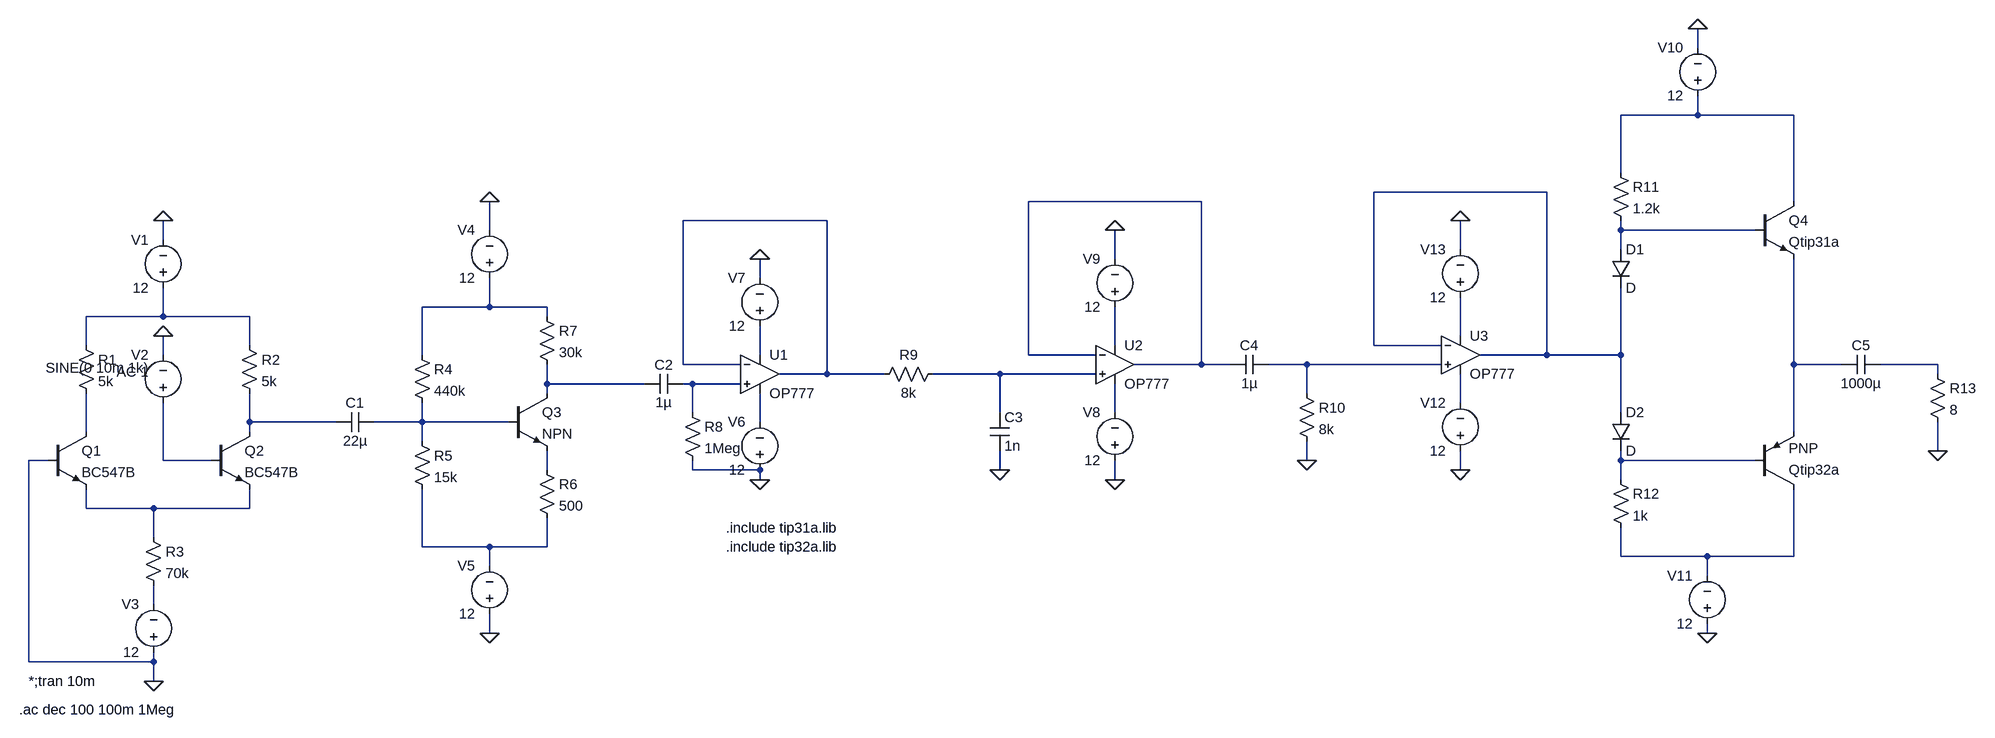
[diagram p0: schematic audamp.asc]
audamp.asc, the LTspice schematic file:
Version 4
SHEET 1 3460 680
WIRE 2992 -560 2992 -592
WIRE 2992 -448 2992 -480
WIRE 2992 -448 2864 -448
WIRE 3152 -448 2992 -448
WIRE 2864 -352 2864 -448
WIRE 2672 -320 2384 -320
WIRE 2096 -304 1808 -304
WIRE 3152 -304 3152 -448
WIRE 1472 -272 1232 -272
WIRE 816 -256 816 -304
WIRE 2864 -256 2864 -272
WIRE 3088 -256 2864 -256
WIRE 272 -240 272 -272
WIRE 2528 -224 2528 -272
WIRE 2864 -224 2864 -256
WIRE 1952 -208 1952 -256
WIRE 1360 -176 1360 -208
WIRE 816 -128 816 -176
WIRE 816 -128 704 -128
WIRE 912 -128 816 -128
WIRE 272 -112 272 -160
WIRE 272 -112 144 -112
WIRE 416 -112 272 -112
WIRE 912 -112 912 -128
WIRE 2528 -80 2528 -144
WIRE 144 -64 144 -112
WIRE 416 -64 416 -112
WIRE 1952 -64 1952 -128
WIRE 2384 -64 2384 -320
WIRE 2496 -64 2384 -64
WIRE 272 -48 272 -80
WIRE 704 -48 704 -128
WIRE 1360 -48 1360 -96
WIRE 1808 -48 1808 -304
WIRE 1920 -48 1808 -48
WIRE 2672 -48 2672 -320
WIRE 2672 -48 2560 -48
WIRE 2864 -48 2864 -160
WIRE 2864 -48 2672 -48
WIRE 1232 -32 1232 -272
WIRE 1328 -32 1232 -32
WIRE 2096 -32 2096 -304
WIRE 2096 -32 1984 -32
WIRE 2144 -32 2096 -32
WIRE 2272 -32 2208 -32
WIRE 2496 -32 2272 -32
WIRE 3152 -32 3152 -208
WIRE 3232 -32 3152 -32
WIRE 3392 -32 3296 -32
WIRE 1472 -16 1472 -272
WIRE 1472 -16 1392 -16
WIRE 1568 -16 1472 -16
WIRE 1760 -16 1648 -16
WIRE 1920 -16 1760 -16
WIRE 3392 -16 3392 -32
WIRE 912 0 912 -32
WIRE 1168 0 912 0
WIRE 1248 0 1232 0
WIRE 1328 0 1248 0
WIRE 912 16 912 0
WIRE 2272 16 2272 -32
WIRE 2528 32 2528 -16
WIRE 1248 48 1248 0
WIRE 1760 48 1760 -16
WIRE 1952 48 1952 0
WIRE 2864 48 2864 -48
WIRE 416 64 416 16
WIRE 560 64 416 64
WIRE 704 64 704 32
WIRE 704 64 624 64
WIRE 848 64 704 64
WIRE 1360 64 1360 16
WIRE 144 80 144 16
WIRE 416 80 416 64
WIRE 3152 80 3152 -32
WIRE 704 96 704 64
WIRE 3392 112 3392 64
WIRE 80 128 48 128
WIRE 272 128 272 32
WIRE 352 128 272 128
WIRE 2272 128 2272 96
WIRE 2864 128 2864 112
WIRE 3088 128 2864 128
WIRE 912 144 912 112
WIRE 1248 144 1248 128
WIRE 1360 144 1248 144
WIRE 1760 144 1760 112
WIRE 2528 144 2528 112
WIRE 1360 160 1360 144
WIRE 1952 160 1952 128
WIRE 2864 160 2864 128
WIRE 144 208 144 176
WIRE 256 208 144 208
WIRE 416 208 416 176
WIRE 416 208 256 208
WIRE 256 256 256 208
WIRE 704 272 704 176
WIRE 816 272 704 272
WIRE 912 272 912 224
WIRE 912 272 816 272
WIRE 2864 288 2864 240
WIRE 3008 288 2864 288
WIRE 3152 288 3152 176
WIRE 3152 288 3008 288
WIRE 816 304 816 272
WIRE 3008 320 3008 288
WIRE 256 368 256 336
WIRE 816 416 816 384
WIRE 3008 416 3008 400
WIRE 48 464 48 128
WIRE 256 464 256 448
WIRE 256 464 48 464
WIRE 256 496 256 464
FLAG 272 -80 0
FLAG 272 -272 0
FLAG 256 496 0
FLAG 816 -304 0
FLAG 816 416 0
FLAG 1360 -208 0
FLAG 1360 160 0
FLAG 1760 144 0
FLAG 1952 160 0
FLAG 1952 -256 0
FLAG 2272 128 0
FLAG 2992 -592 0
FLAG 3008 416 0
FLAG 3392 112 0
FLAG 2528 144 0
FLAG 2528 -272 0
SYMBOL npn 80 80 R0
SYMATTR InstName Q1
SYMATTR Value BC547B
SYMBOL npn 352 80 R0
SYMATTR InstName Q2
SYMATTR Value BC547B
SYMBOL voltage 272 -144 R180
WINDOW 0 24 96 Left 2
WINDOW 3 24 16 Left 2
WINDOW 123 0 0 Left 0
WINDOW 39 0 0 Left 0
SYMATTR InstName V1
SYMATTR Value 12
SYMBOL voltage 272 48 R180
WINDOW 0 24 96 Left 2
WINDOW 3 24 74 Left 2
WINDOW 123 24 68 Left 2
WINDOW 39 0 0 Left 0
SYMATTR InstName V2
SYMATTR Value SINE(0 10m 1k)
SYMATTR Value2 AC 1
SYMBOL voltage 256 464 R180
WINDOW 0 24 96 Left 2
WINDOW 3 24 16 Left 2
WINDOW 123 0 0 Left 0
WINDOW 39 0 0 Left 0
SYMATTR InstName V3
SYMATTR Value 12
SYMBOL res 128 -80 R0
SYMATTR InstName R1
SYMATTR Value 5k
SYMBOL res 400 -80 R0
SYMATTR InstName R2
SYMATTR Value 5k
SYMBOL res 240 240 R0
SYMATTR InstName R3
SYMATTR Value 70k
SYMBOL cap 624 48 R90
WINDOW 0 0 32 VBottom 2
WINDOW 3 32 32 VTop 2
SYMATTR InstName C1
SYMATTR Value 22µ
SYMBOL res 688 -64 R0
SYMATTR InstName R4
SYMATTR Value 440k
SYMBOL res 688 80 R0
SYMATTR InstName R5
SYMATTR Value 15k
SYMBOL res 896 128 R0
SYMATTR InstName R6
SYMATTR Value 500
SYMBOL res 896 -128 R0
SYMATTR InstName R7
SYMATTR Value 30k
SYMBOL npn 848 16 R0
SYMATTR InstName Q3
SYMBOL voltage 816 -160 R180
WINDOW 0 24 96 Left 2
WINDOW 3 24 16 Left 2
WINDOW 123 0 0 Left 0
WINDOW 39 0 0 Left 0
SYMATTR InstName V4
SYMATTR Value 12
SYMBOL voltage 816 400 R180
WINDOW 0 24 96 Left 2
WINDOW 3 24 16 Left 2
SYMATTR InstName V5
SYMATTR Value 12
SYMBOL OP777 1360 -80 R0
SYMATTR InstName U1
SYMBOL voltage 1360 160 R180
WINDOW 0 24 96 Left 2
WINDOW 3 24 16 Left 2
SYMATTR InstName V6
SYMATTR Value 12
SYMBOL voltage 1360 -80 R180
WINDOW 0 24 96 Left 2
WINDOW 3 24 16 Left 2
SYMATTR InstName V7
SYMATTR Value 12
SYMBOL res 1664 -32 R90
WINDOW 0 0 56 VBottom 2
WINDOW 3 32 56 VTop 2
SYMATTR InstName R9
SYMATTR Value 8k
SYMBOL cap 1744 48 R0
SYMATTR InstName C3
SYMATTR Value 1n
SYMBOL OP777 1952 -96 R0
SYMATTR InstName U2
SYMBOL voltage 1952 144 R180
WINDOW 0 24 96 Left 2
WINDOW 3 24 16 Left 2
SYMATTR InstName V8
SYMATTR Value 12
SYMBOL voltage 1952 -112 R180
WINDOW 0 24 96 Left 2
WINDOW 3 24 16 Left 2
SYMATTR InstName V9
SYMATTR Value 12
SYMBOL cap 2208 -48 R90
WINDOW 0 0 32 VBottom 2
WINDOW 3 32 32 VTop 2
SYMATTR InstName C4
SYMATTR Value 1µ
SYMBOL res 2256 0 R0
SYMATTR InstName R10
SYMATTR Value 8k
SYMBOL cap 1232 -16 R90
WINDOW 0 0 32 VBottom 2
WINDOW 3 32 32 VTop 2
SYMATTR InstName C2
SYMATTR Value 1µ
SYMBOL res 1232 32 R0
SYMATTR InstName R8
SYMATTR Value 1Meg
SYMBOL diode 2848 -224 R0
SYMATTR InstName D1
SYMBOL diode 2848 48 R0
SYMATTR InstName D2
SYMBOL res 2848 -368 R0
SYMATTR InstName R11
SYMATTR Value 1.2k
SYMBOL res 2848 144 R0
SYMATTR InstName R12
SYMATTR Value 1k
SYMBOL npn 3088 -304 R0
SYMATTR InstName Q4
SYMATTR Value Qtip31a
SYMBOL pnp 3088 176 M180
SYMATTR InstName Qtip32a
SYMBOL voltage 2992 -464 R180
WINDOW 0 24 96 Left 2
WINDOW 3 24 16 Left 2
SYMATTR InstName V10
SYMATTR Value 12
SYMBOL voltage 3008 416 R180
WINDOW 0 24 96 Left 2
WINDOW 3 24 16 Left 2
SYMATTR InstName V11
SYMATTR Value 12
SYMBOL cap 3296 -48 R90
WINDOW 0 0 32 VBottom 2
WINDOW 3 32 32 VTop 2
SYMATTR InstName C5
SYMATTR Value 1000µ
SYMBOL res 3376 -32 R0
SYMATTR InstName R13
SYMATTR Value 8
SYMBOL OP777 2528 -112 R0
SYMATTR InstName U3
SYMBOL voltage 2528 128 R180
WINDOW 0 24 96 Left 2
WINDOW 3 24 16 Left 2
SYMATTR InstName V12
SYMATTR Value 12
SYMBOL voltage 2528 -128 R180
WINDOW 0 24 96 Left 2
WINDOW 3 24 16 Left 2
SYMATTR InstName V13
SYMATTR Value 12
TEXT 48 496 Left 2 !*;tran 10m
TEXT 1304 240 Left 2 !.include tip31a.lib
TEXT 1304 272 Left 2 !.include tip32a.lib
TEXT 32 544 Left 2 !.ac dec 100 100m 1Meg

The netlist it stands for:
* audamp.asc
Q1 N022 0 N026 0 BC547B
Q2 N019 N023 N026 0 BC547B
V1 N007 0 12
V2 N023 0 SINE(0 10m 1k) AC 1
V3 0 N029 12
R1 N007 N022 5k
R2 N007 N019 5k
R3 N026 N029 70k
C1 N020 N019 22µ
R4 N006 N020 440k
R5 N020 N027 15k
R6 N025 N027 500
R7 N006 N015 30k
Q3 N015 N020 N025 0 NPN
V4 N006 0 12
V5 0 N027 12
XU1 N016 N004 N010 N021 N004 OP777  ; pins In+ In- V+ V- OUT
V6 0 N021 12
V7 N010 0 12
R9 N014 N004 8k
C3 N014 0 1n
XU2 N014 N003 N009 N018 N003 OP777  ; pins In+ In- V+ V- OUT
V8 0 N018 12
V9 N009 0 12
C4 N011 N003 1µ
R10 N011 0 8k
C2 N016 N015 1µ
R8 N016 0 1Meg
D1 N005 N002 D
D2 N002 N024 D
R11 N001 N005 1.2k
R12 N024 N028 1k
Q4 N001 N005 N012 0 Qtip31a
Qtip32a N028 N024 N012 0 PNP
V10 N001 0 12
V11 0 N028 12
C5 N013 N012 1000µ
R13 N013 0 8
XU3 N011 N002 N008 N017 N002 OP777  ; pins In+ In- V+ V- OUT
V12 0 N017 12
V13 N008 0 12
.model D D
.lib standard.dio
.model NPN NPN
.model PNP PNP
.lib standard.bjt
*;tran 10m
.include tip31a.lib
.include tip32a.lib
.ac dec 100 100m 1Meg
.lib ADI.lib
.backanno
.end